# Altium schematic sheet 电机.SchDoc
size A4
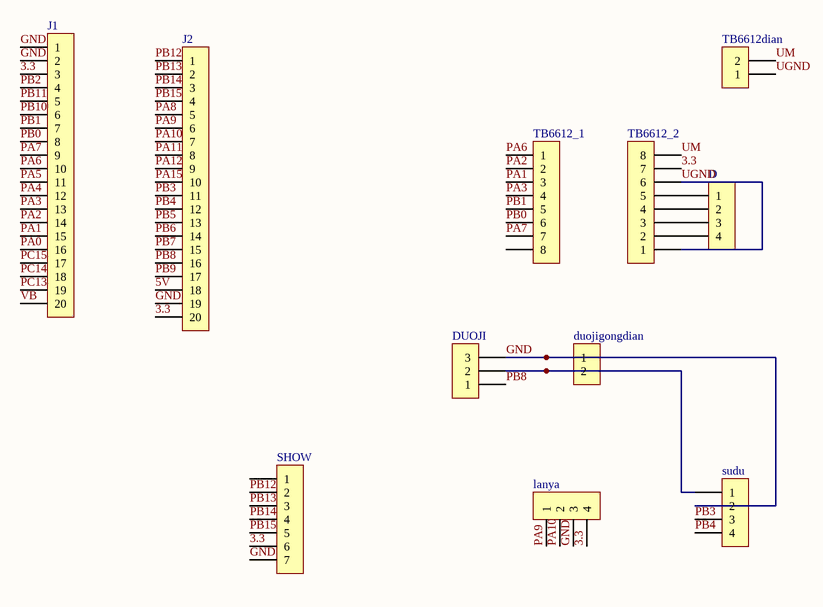
[diagram p0: 电机.SchDoc]

## Parts
D  (no value)  [Fe-HDR1X4/2.54-S]
DUOJI  (no value)  [Pin HDR1X3/2.54mm-S]
duojigongdian  (no value)  [Pin HDR1X2/2.54mm-S]
J1  (no value)  [Fe-HDR1X20/2.54-S]
J2  (no value)  [Fe-HDR1X20/2.54-S]
lanya  (no value)  [Pin HDR1X4/2.54mm-S]
SHOW  (no value)  [Fe-HDR1X7/2.54-S]
sudu  (no value)  [Fe-HDR1X4/2.54-S]
TB6612_1  (no value)  [Fe-HDR1X8/2.54-S]
TB6612_2  (no value)  [Fe-HDR1X8/2.54-S]
TB6612dian  (no value)  [Pin HDR1X2/2.54mm-S]

## Nets
3.3: J1.3 J2.20 lanya.4 SHOW.6 TB6612_2.7
5V: J2.18
GND: DUOJI.3 duojigongdian.1 J1.1 J1.2 J2.19 lanya.3 SHOW.7 sudu.2
PA0: J1.16
PA1: J1.15 TB6612_1.3
PA2: J1.14 TB6612_1.2
PA3: J1.13 TB6612_1.4
PA4: J1.12
PA5: J1.11
PA6: J1.10 TB6612_1.1
PA7: J1.9 TB6612_1.7
PA8: J2.5
PA9: J2.6 lanya.1
PA10: J2.7 lanya.2
PA11: J2.8
PA12: J2.9
PA15: J2.10
PB0: J1.8 TB6612_1.6
PB1: J1.7 TB6612_1.5
PB2: J1.4
PB3: J2.11 sudu.3
PB4: J2.12 sudu.4
PB5: J2.13
PB6: J2.14
PB7: J2.15
PB8: DUOJI.1 J2.16
PB9: J2.17
PB10: J1.6
PB11: J1.5
PB12: J2.1 SHOW.2
PB13: J2.2 SHOW.3
PB14: J2.3 SHOW.4
PB15: J2.4 SHOW.5
PC13: J1.19
PC14: J1.18
PC15: J1.17
UGND: TB6612_2.1 TB6612_2.6 TB6612dian.1
UM: TB6612_2.8 TB6612dian.2
VB: J1.20
NetD_1: D.1 TB6612_2.5
NetD_2: D.2 TB6612_2.4
NetD_3: D.3 TB6612_2.3
NetD_4: D.4 TB6612_2.2
NetDUOJI_2: DUOJI.2 duojigongdian.2 sudu.1

Not connected (* = marked no-connect by the designer): SHOW 1; TB6612_1 8

## Library data of the parts
D sudu = Female HDR1X4
DUOJI = Pin HDR1X3
duojigongdian TB6612dian = Pin HDR1X2
J1 J2 = Female HDR1X20
lanya = Pin HDR1X4
SHOW = Female HDR1X7
TB6612_1 TB6612_2 = Female HDR1X8